# EAGLE design single breakoutmicrosh (EAGLE 9.3.0)
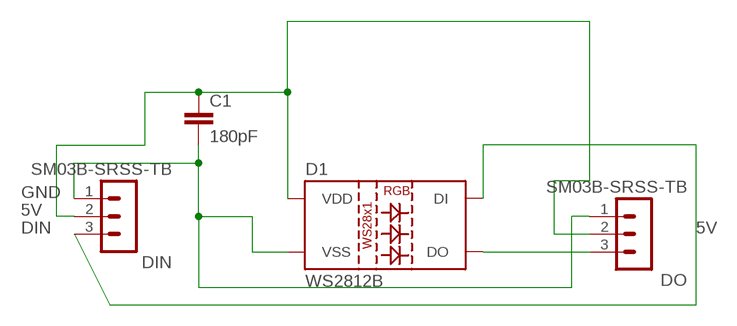
[diagram p0: schematic, sheet 1]

## Parts
C1  180pF  180PF-0603-50V-5%  [0603]
D1  WS2812B  [WS2812B]
DIN  SM03B-SRSS-TB  [SM03B-SRSS-TB]
DO  SM03B-SRSS-TB  [SM03B-SRSS-TB]

## Nets
5V: C1.1 D1.1(VDD) DIN.2 DO.2
DIN: D1.4(DI) DIN.3
DO: D1.2(DO) DO.3
GND: C1.2 D1.3(VSS) DIN.1 DO.1

## Library data of the parts
C1 = SparkFun-Capacitors:180PF: 180pF/0.18nF ceramic capacitors A capacitor is a passive two-terminal electrical component used to store electrical energy temporarily in an electric field.; PROD_ID: CAP-11661
D1 = SparkFun-LED:WS2812B: WS2812B SMD addressable RGB LED 5x5mm SMD LED with built-in controller IC. Color: Red/Green/Blue mC Rating: RGB: 390, 660, 180 mcd Forward Voltage: RGB: 2.0, 3.0, 3.0 V Packages:WS2812B SparkFun Products: Blynk Board - ESP8266 <https://www.sparkfun.com/products/13794>; PROD_ID: DIO-12503
DIN DO = con-JST SH:SM03B-SRSS: JST SH series header 1.00mm pitch disconnectable crimp style connectors, horizontal (side entry type), 3 pins

## Board
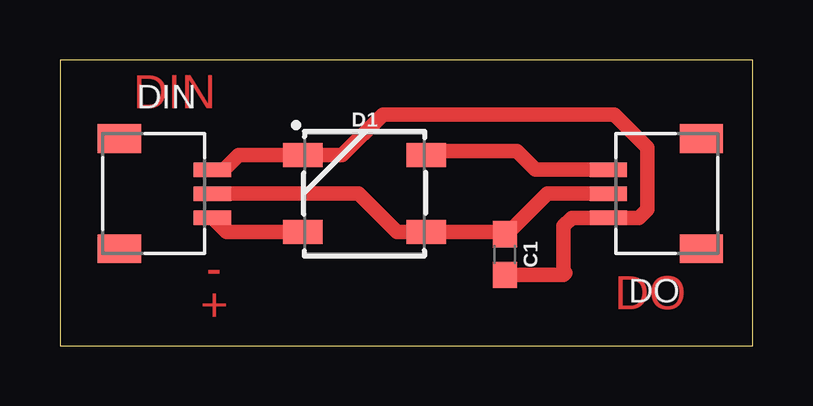
[diagram p1: board, top side]

Size 28.88 x 11.93 mm. Coordinates in mm from the lower left corner, seen from the top.
Outline: 0,0 28.88,0 28.88,11.93 0,11.93 0,0
Copper layers (1*16): Top 0.035mm / dielectric 1.5mm / Bottom 0.035mm
Design rules "default": minimum track width 6mil, minimum drill 0.35mm, track to track 6mil, track to pad 6mil, pad to pad 6mil, via to via 6mil, smd to smd 6mil, copper to edge 40mil, drill to drill 6mil, minimum pad ring 10mil, minimum via ring 8mil, stop-mask expansion 4mil, vias tented up to drill 0mil, thermal gap 10mil

### Footprints (pad centres in the part's own frame; a part is rotated, then mirrored left to right if it is on the bottom)
0603 = smd 1.1 x 1: 1 -0.85,0; 2 0.85,0
WS2812B = smd 1.651 x 1: 1 2.577,-1.6; 2 2.577,1.6; 3 -2.577,1.6; 4 -2.577,-1.6
SM03B-SRSS-TB = smd 0.6 x 1.55: 1 1,0; 2 0,0; 3 -1,0 | smd 1.2 x 1.8: M1 2.3,3.875; M2 -2.3,3.875

### Placement (x,y rotation side)
C1  18.54,3.81 270 top
D1  12.7,6.35 0 top
DIN  6.35,6.35 90 top
DO  22.86,6.35 270 top

### Tracks (layer width: path | path; a pad name or v marks a point on that pad's centre or on a via)
5V
  Top 0.61: DIN.2 12.45,6.35 14.05,4.75 D1.1 18.45,4.75 C1.1 18.63,4.66 20.32,6.35 DO.2
DIN
  Top 0.61: DIN.3 6.95,4.75 D1.4
DO
  Top 0.61: DO.3 19.83,7.35 19.05,8.13 15.46,8.13 D1.2
GND
  Top 0.61: DIN.1 6.84,7.35 7.44,7.95 D1.3 11.76,7.95 13.46,9.65 23.11,9.65 24.49,8.28 24.49,5.69 24.13,5.33 22.84,5.33 | C1.2 20.99,2.96 | 20.99,2.96 21.08,3.05 | DO.1 22.84,5.33 | 22.84,5.33 21.34,5.33 20.99,4.99 20.99,2.96

### Text on the board
Top: DIN | - | + | DO